# Altium schematic sheet AD620_IA.SchDoc
size A
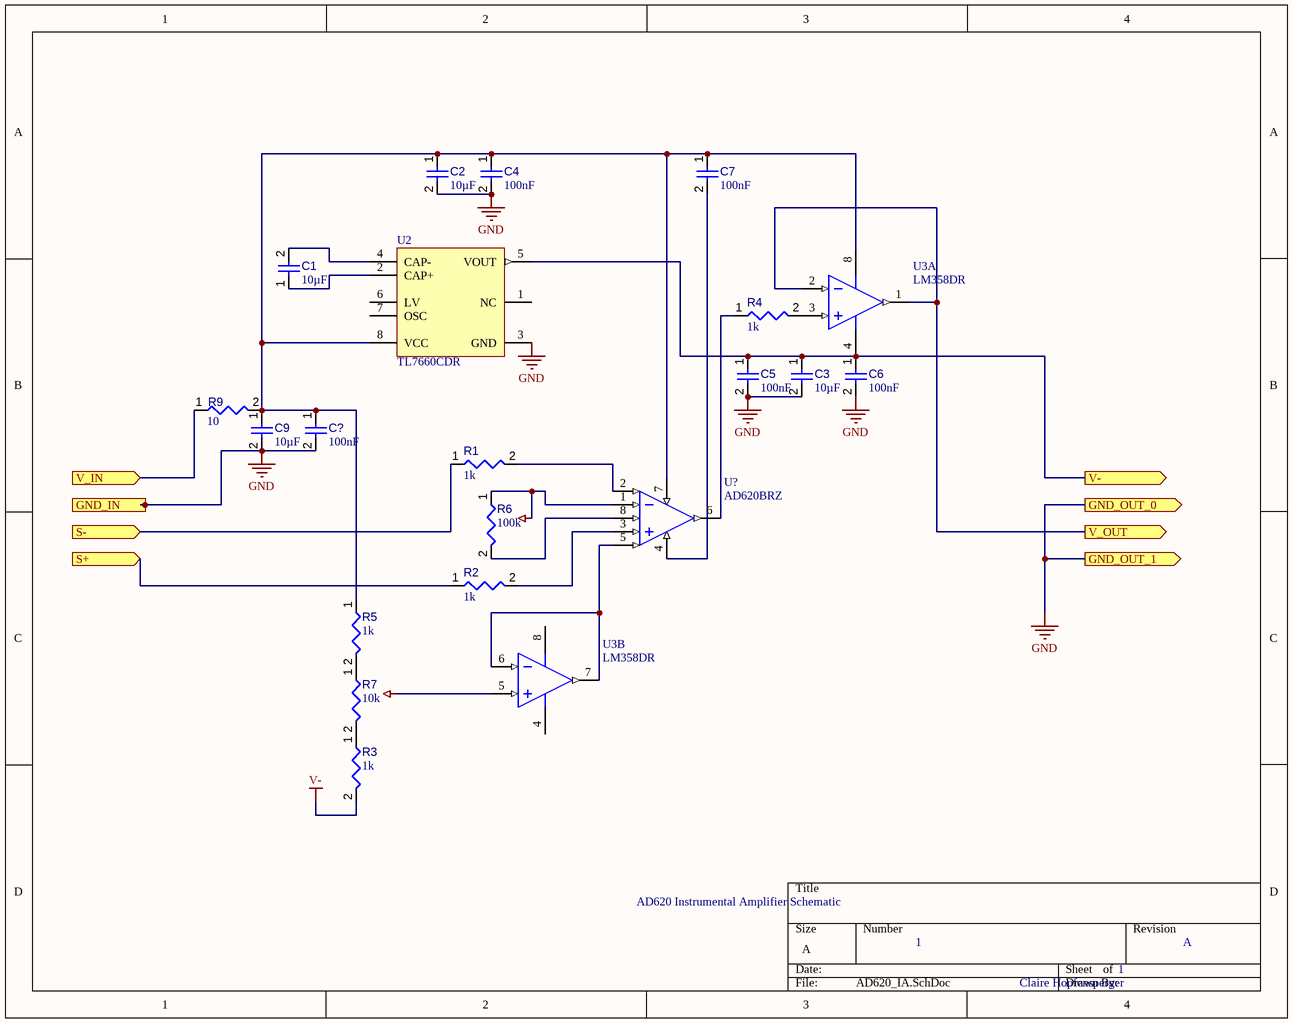
[diagram p0: AD620_IA.SchDoc]

## Parts
C1  value 10µF  [GRM188R60J106ME47D]  (hidden comment: GRM188R60J106ME47D)
C2  value 10µF  [GRM188R60J106ME47D]  (hidden comment: GRM188R60J106ME47D)
C3  value 10µF  [GRM188R60J106ME47D]  (hidden comment: GRM188R60J106ME47D)
C4  value 100nF  [CC0603KRX5R8BB104]  (hidden comment: CC0603KRX5R8BB104)
C5  value 100nF  [CC0603KRX5R8BB104]  (hidden comment: CC0603KRX5R8BB104)
C6  value 100nF  [CC0603KRX5R8BB104]  (hidden comment: CC0603KRX5R8BB104)
C7  value 100nF  [CC0603KRX5R8BB104]  (hidden comment: CC0603KRX5R8BB104)
C9  value 10µF  [GRM188R60J106ME47D]  (hidden comment: GRM188R60J106ME47D)
C?  value 100nF  [CC0603KRX5R8BB104]  (hidden comment: CC0603KRX5R8BB104)
R1  value 1k  [CRCW06031K00FKEA]  (hidden comment: CRCW06031K00FKEA)
R2  value 1k  [CRCW06031K00FKEA]  (hidden comment: CRCW06031K00FKEA)
R3  value 1k  [CRCW06031K00FKEA]  (hidden comment: CRCW06031K00FKEA)
R4  value 1k  [CRCW06031K00FKEA]  (hidden comment: CRCW06031K00FKEA)
R5  value 1k  [CRCW06031K00FKEA]  (hidden comment: CRCW06031K00FKEA)
R6  value 100k  [RC0603FR-07100KL]  (hidden comment: RC0603FR-07100KL)
R7  value 10k  [MCT06030C1002FP500]  (hidden comment: MCT06030C1002FP500)
R9  value 10  [CRCW060310R0FKEA]  (hidden comment: CRCW060310R0FKEA)
U2  TL7660CDR  [D0008A_N]
U3  LM358DR  [D0008A_L]  (parts A,B of 2)
U?  AD620BRZ  [AD620BRZ]

## Ports
GND_IN (in), GND_OUT_0 (out), GND_OUT_1 (out), S+ (in), S- (in), V- (out), V_IN (in), V_OUT (out)

## Nets
GND: C2.2 C3.2 C4.2 C5.2 C6.2 C9.2 C?.2 U2.3(GND) ; port GND_IN, port GND_OUT_0, port GND_OUT_1
NetR6_1: R6.1 U3.5(2IN+) U?.1(R_G)
V-: R3.2
S+: R2.1 ; port S+
S-: R1.1 ; port S-
V-: C3.1 C5.1 C6.1 U2.5(VOUT) U3.4(GND) ; port V-  [a separate net that carries the same name]
V_IN: R9.1 ; port V_IN
V_OUT: U3.1(1OUT) U3.2(1IN-) ; port V_OUT
NetC1_1: C1.1 U2.2(CAP+)
NetC1_2: C1.2 U2.4(CAP-)
NetC2_1: C2.1 C4.1 C7.1 C9.1 C?.1 R5.1 R9.2 U2.8(VCC) U3.8(VCC) U?.7(+V_S)
NetC7_2: C7.2 U?.4(-V_S)
NetR1_2: R1.2 U?.2(-IN)
NetR2_2: R2.2 U?.3(+IN)
NetR3_1: R3.1 R7.2
NetR4_1: R4.1 U?.6(OUT)
NetR4_2: R4.2 U3.3(1IN+)
NetR5_2: R5.2 R7.1
NetR6_2: R6.2 U?.8(R_G)
NetU3_6: U3.6(2IN-) U3.7(2OUT) U?.5(REF)

Not connected (* = marked no-connect by the designer): U2 1(NC) 6(LV) 7(OSC)

## Notes on the sheet
- AD620 Instrumental Amplifier Schematic
- 1
- A
- Claire Hopfensperger

## Library data of the parts
C1-C3 C9 = CMP-001-00088-1: Ceramic Capacitor, Multilayer, Ceramic, 6.3V, 20% +Tol, 20% -Tol, X5R, 15% TC, 10uF, Surface Mount, 0603; Pins: 2; Mounting Technology: Surface Mount; Case/Package: 0603; Min Operating Temperature: -55°C; RoHS Compliant: Yes; Max Operating Temperature: 85°C; Capacitor Type: Ceramic
C4-C7 C? = CMP-001-00086-2: Capacitor, 0.1UF, X5R, 0603 Rohs Compliant: Yes; Pins: 2
R1-R5 = CMP-009-00182-1: Fixed Resistor, Metal Glaze/thick Film, 0.1W, 1000ohm, 75V, 1% +/-Tol, 100ppm/Cel, Surface Mount, 0603; Power: 100mW; Mounting Technology: Surface Mount; RoHS Compliant: Yes; Case/Package: 0603; Min Operating Temperature: -55°C; Max Operating Temperature: 155°C; Pins: 2; Tolerance: 1%
R6 = CMP-009-00185-1: Fixed Resistor, Metal Glaze/thick Film, 0.1W, 100000ohm, 75V, 1% +/-Tol, 100ppm/Cel, Surface Mount, 0603; Power: 100mW; Max Operating Temperature: 155°C; Mounting Technology: Surface Mount; Pins: 2; Case/Package: 0603; Min Operating Temperature: -55°C; Tolerance: 1%; RoHS Compliant: Yes
R7 = CMP-009-00183-1: Fixed Resistor, Thin Film, 0.1W, 10000ohm, 75V, 1% +/-Tol, 50ppm/Cel, Surface Mount, 0603; Power: 100mW; Mounting Technology: Surface Mount; Case/Package: 0603; Pins: 2; Max Operating Temperature: 125°C; Tolerance: 1%; RoHS Compliant: Yes; Min Operating Temperature: -55°C
R9 = CMP-009-00184-1: Fixed Resistor, Metal Glaze/thick Film, 0.1W, 10ohm, 75V, 1% +/-Tol, 100ppm/Cel, Surface Mount, 0603; Power: 100mW; RoHS Compliant: Yes; Case/Package: 0603; Pins: 2; Mounting Technology: Surface Mount; Max Operating Temperature: 155°C; Min Operating Temperature: -55°C; Tolerance: 1%
U2 = CMP-031-00007-1: Switched Capacitor Converter, 0.1A, 100kHz Switching Freq-Max, CMOS, PDSO8; Max Supply Voltage: 10V; Pins: 8; RoHS Compliant: Yes; Case/Package: SOP; Max Operating Temperature: 85°C; Min Operating Temperature: -40°C
U3 = CMP-014-00024-2: Dual Operational Amplifier, 3 to 32 V, 0 to 70 degC, 8-Pin SOIC (D), Green (RoHS & no Sb/Br), Tape and Reel; Manufacturer: Texas Instruments (TI); Channels: 2; Min Supply Voltage: 1.5V; Max Supply Voltage: 16V; Package Version: 4040047-3/M, 06/2011; Common Mode Rejection Ratio: 65dB; Nominal Dual Supply Voltage: 12V; Output Current: 30mA; Slew Rate: 0.3V/us; Unity Gain Bandwidth Product: 700KHz; Nominal Supply Current: 1.2mA; Nominal Voltage Gain: 100dB; Packaging: CutTape; Manufacturer URL: http://www.ti.com/; RoHS Compliant: True; Datasheet Version: SLOS068T, 04/2015; Min Dual Supply Voltage: 1.5V; Max Operating Temperature: 70°C; Package Description: 8-Pin Small Outline Integrated Circuit, Body 4.9 x 3.9 mm, Pitch 1.27 mm; Package Reference: D0008A; Max Dual Supply Voltage: 16V; Nominal Supply Voltage: 12V; Mounting Technology: SM; Datasheet URL: http://www.ti.com/lit/ds/symlink/lm358.pdf; Case/Package: SOIC; Package URL: http://www.ti.com/lit/ml/msoi002j/msoi002j.pdf; Min Operating Temperature: 0°C; Pins: 8; Package Quantity: 1; Nominal Gain Bandwith Product: 700KHz
U? = CMP-014-00003-3: Instrumentation Amplifier, 1 Func, 85uV Offset-Max, 1MHz Band Width, PDSO8; Channels: 1; Nominal Supply Voltage: 15V; Min Operating Temperature: -40°C; Case/Package: SOP; Pins: 8; Max Operating Temperature: 85°C; RoHS Compliant: Yes